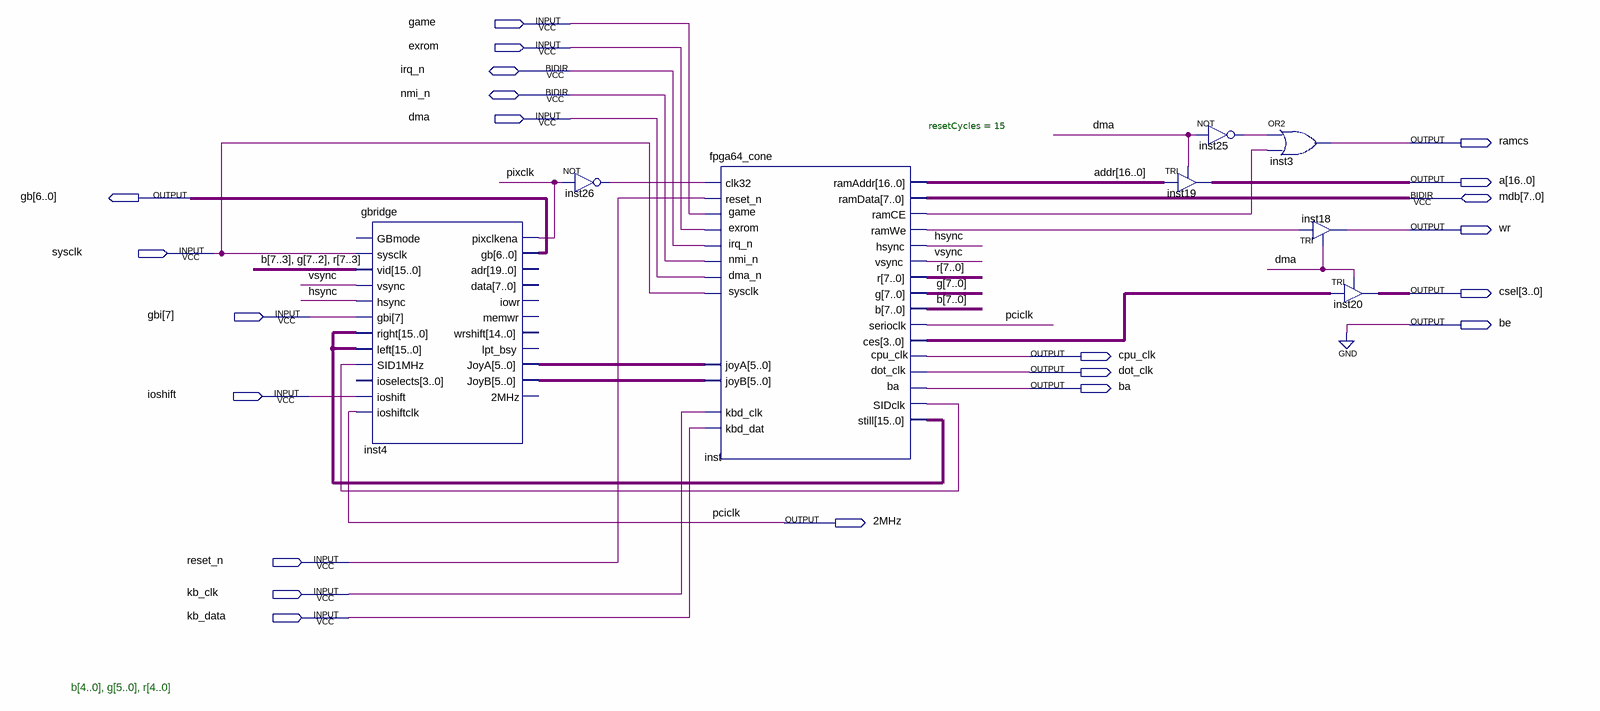
[diagram p0: schematic sheet]
// Quartus schematic fpga64_top.bdf as structural Verilog: 8 symbols, 22 pins
module fpga64_top (
  input  game,
  input  exrom,
  input  dma,
  input  sysclk,
  input  [7:7] gbi,
  input  ioshift,
  input  reset_n,
  input  kb_clk,
  input  kb_data,
  inout  irq_n,
  inout  nmi_n,
  inout  [7:0] mdb,
  output ramcs,
  output [16:0] a,
  output [6:0] gb,
  output wr,
  output [3:0] csel,
  output be,
  output cpu_clk,
  output dot_clk,
  output ba,
  output \2MHz 
);

  wire hsync, inst25_out, inst26_out, inst_ramce, inst_ramwe, inst_sidclk, pixclk, vsync;
  wire [3:0] inst_ces;
  wire [5:0] inst4_joya, inst4_joyb;
  wire [7:0] b, g, r;
  wire [15:0] inst_still;
  wire [16:0] addr;

  gbridge inst4 (
    .sysclk(sysclk), .vid({b[7:3], g[7:2], r[7:3]}), .vsync(vsync), .hsync(hsync), .gbi(gbi[7]),
    .right(inst_still), .left(inst_still), .SID1MHz(inst_sidclk), .ioshift(ioshift), .ioshiftclk(\2MHz ),
    .pixclkena(pixclk), .gb(gb), .JoyA(inst4_joya), .JoyB(inst4_joyb));  // open: GBmode, ioselects, adr, data, iowr, memwr, wrshift, lpt_bsy, 2MHz
  not inst26 (inst26_out, pixclk);
  fpga64_cone #(.resetCycles(15)) inst (
    .clk32(inst26_out), .kbd_clk(kb_clk), .kbd_dat(kb_data), .joyA(inst4_joya), .joyB(inst4_joyb),
    .game(game), .exrom(exrom), .reset_n(reset_n), .dma_n(dma), .sysclk(sysclk), .ramAddr(addr),
    .ramCE(inst_ramce), .ramWe(inst_ramwe), .hsync(hsync), .vsync(vsync), .r(r), .g(g), .b(b),
    .serioclk(\2MHz ), .ces(inst_ces), .SIDclk(inst_sidclk), .still(inst_still), .dot_clk(dot_clk),
    .cpu_clk(cpu_clk), .ba(ba), .ramData(mdb), .irq_n(irq_n), .nmi_n(nmi_n));
  TRI inst19[16:0] (.IN(addr), .OE(dma), .OUT(a));
  not inst25 (inst25_out, dma);
  or inst3 (ramcs, inst25_out, inst_ramce);
  TRI inst18 (.IN(inst_ramwe), .OE(dma), .OUT(wr));
  TRI inst20[3:0] (.IN(inst_ces), .OE(dma), .OUT(csel));

  assign be = 1'b0;

  // Other names for the same wires on the sheet: pciclk = \2MHz 

  // Notes on the sheet:
  //   b[4..0], g[5..0], r[4..0]
endmodule
